# Altium project DC_DC_BOOST_CONVERTER_SOLAR.PrjPcb
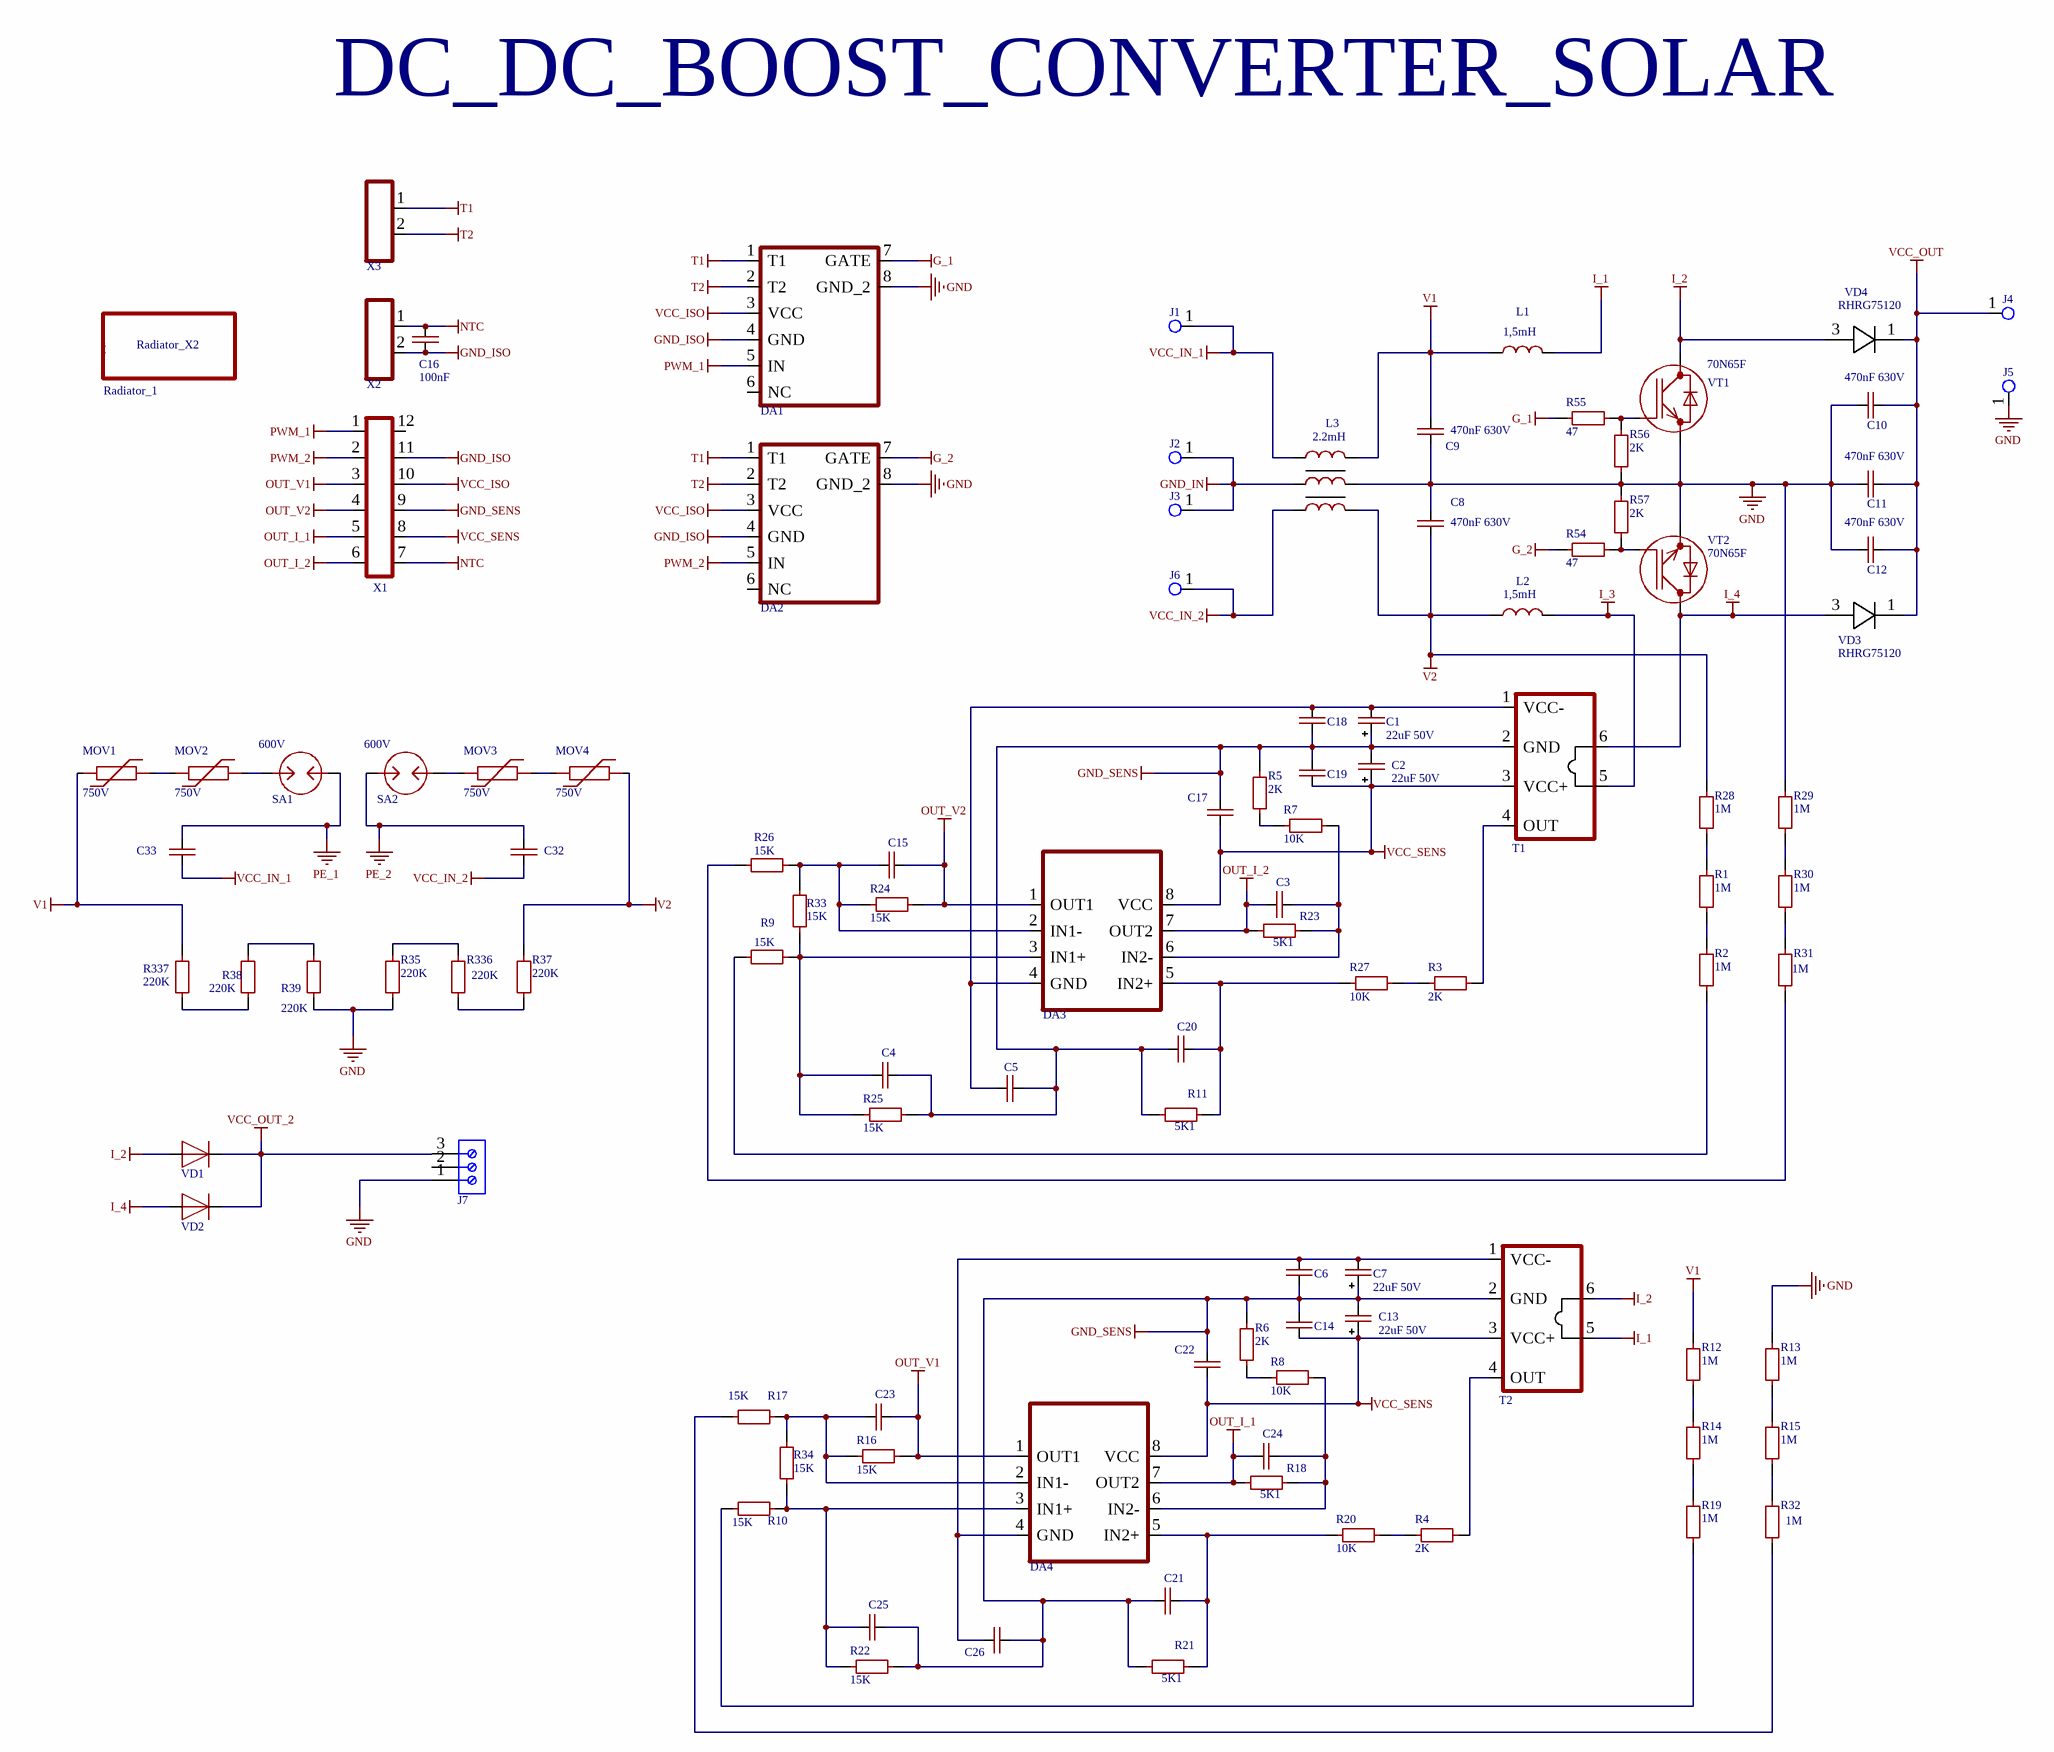
[diagram p0: DC_DC_BOOST_CONVERTER_SOLAR.SchDoc]
1 sheet, 104 parts. Net scope: global (net labels, ports and power ports of the same name join across sheets).
Board file: DC_DC_BOOST_CONVERTER_SOLAR.PcbDoc

## Sheet DC_DC_BOOST_CONVERTER_SOLAR.SchDoc
size A0; SheetNumber: 1; SheetTotal: 1; SPICEModelCacheYQEDCYZF: <root> / <DocumentId>YQEDCYZF</DocumentId> / </root>

### Parts
C1  22uF 50V  [CAPPOL_SMD_SIZE_E]
C2  22uF 50V  [CAPPOL_SMD_SIZE_E]
C3  (no value)  [CAP-0805]
C4  (no value)  [CAP-0805]
C5  (no value)  [CAP-0805]
C6  (no value)  [CAP-0805]
C7  22uF 50V  [CAPPOL_SMD_SIZE_E]
C8  470nF 630V  [CAP-FILM-22.5X26.5X10]
C9  470nF 630V  [CAP-FILM-22.5X26.5X10]
C10  470nF 630V  [CAP-FILM-22.5X26.5X10]
C11  470nF 630V  [CAP-FILM-22.5X26.5X10]
C12  470nF 630V  [CAP-FILM-22.5X26.5X10]
C13  22uF 50V  [CAPPOL_SMD_SIZE_E]
C14  (no value)  [CAP-0805]
C15  (no value)  [CAP-0805]
C16  100nF  [CAP-0805]
C17  (no value)  [CAP-0805]
C18  (no value)  [CAP-0805]
C19  (no value)  [CAP-0805]
C20  (no value)  [CAP-0805]
C21  (no value)  [CAP-0805]
C22  (no value)  [CAP-0805]
C23  (no value)  [CAP-0805]
C24  (no value)  [CAP-0805]
C25  (no value)  [CAP-0805]
C26  (no value)  [CAP-0805]
C32  (no value)  [CAP-V]
C33  (no value)  [CAP-V]
DA1  DRIVER_GATE_BOARD_solar_boost_converter  [DRIVER_GATE_BOARD_solar_boost_converter]  (value not drawn)
DA2  DRIVER_GATE_BOARD_solar_boost_converter  [DRIVER_GATE_BOARD_solar_boost_converter]  (value not drawn)
DA3  LM358  [SOIC8-150]  (value not drawn)
DA4  LM358  [SOIC8-150]  (value not drawn)
J1  (no value)  [Klema_PCB_15A]
J2  (no value)  [Klema_PCB_15A]
J3  (no value)  [Klema_PCB_15A]
J4  (no value)  [Klema_PCB_15A]
J5  (no value)  [Klema_PCB_15A]
J6  (no value)  [Klema_PCB_15A]
J7  691101710003  [691101710003]  (value not drawn)
L1  1,5mH  [DROSSEL_TOR_50X30X20]
L2  1,5mH  [DROSSEL_TOR_50X30X20]
L3  2.2mH  [DROSSEL_TOR_50X30X20X3]
MOV1  750V  [VARISTOR_20MM]
MOV2  750V  [VARISTOR_20MM]
MOV3  750V  [VARISTOR_20MM]
MOV4  750V  [VARISTOR_20MM]
R1  1M  [RES-1206]
R2  1M  [RES-1206]
R3  2K  [RES-0805]
R4  2K  [RES-0805]
R5  2K  [RES-0805]
R6  2K  [RES-0805]
R7  10K  [RES-0805]
R8  10K  [RES-0805]
R9  15K  [RES-0805]
R10  15K  [RES-0805]
R11  5K1  [RES-0805]
R12  1M  [RES-1206]
R13  1M  [RES-1206]
R14  1M  [RES-1206]
R15  1M  [RES-1206]
R16  15K  [RES-0805]
R17  15K  [RES-0805]
R18  5K1  [RES-0805]
R19  1M  [RES-1206]
R20  10K  [RES-0805]
R21  5K1  [RES-0805]
R22  15K  [RES-0805]
R23  5K1  [RES-0805]
R24  15K  [RES-0805]
R25  15K  [RES-0805]
R26  15K  [RES-0805]
R27  10K  [RES-0805]
R28  1M  [RES-1206]
R29  1M  [RES-1206]
R30  1M  [RES-1206]
R31  1M  [RES-1206]
R32  1M  [RES-1206]
R33  15K  [RES-0805]
R34  15K  [RES-0805]
R35  220K  [RES-1206]
R37  220K  [RES-1206]
R38  220K  [RES-1206]
R39  220K  [RES-1206]
R54  47  [RES-1206]
R55  47  [RES-1206]
R56  2K  [RES-1206]
R57  2K  [RES-1206]
R336  220K  [RES-1206]
R337  220K  [RES-1206]
Radiator_1  Radiator_X2  [Radiator_X2]  (value not drawn)
SA1  600V  [SPARK_GAP]
SA2  600V  [SPARK_GAP]
T1  STB-HAA20  [STB-HAA20]  (value not drawn)
T2  STB-HAA20  [STB-HAA20]  (value not drawn)
VD1  DIODE  [DIODE_R6]  (value not drawn)
VD2  DIODE  [DIODE_R6]  (value not drawn)
VD3  RHRG75120  [TO-247-2]
VD4  RHRG75120  [TO-247-2]
VT1  70N65F  [TO-247-3]
VT2  70N65F  [TO-247-3]
X1  CONN_IDC_12_PIN2.54  [CONN_IDC_12_PIN2.54]  (value not drawn)
X2  CONN-2-PIN  [XH2-]  (value not drawn)
X3  CONN-2-PIN  [XH2-]  (value not drawn)

### Nets
G_1: DA1.7(GATE) R55.2
G_2: DA2.7(GATE) R54.2
GND: C8.1 C9.2 C10.1 C11.1 C12.1 DA1.8(GND_2) DA2.8(GND_2) J5.1 J7.1 L3.4 R13.1 R29.1 R35.2 R39.2 R56.2 R57.1 VT1.3(E) VT2.3(E)
GND_IN: J2.1 J3.1 L3.3
GND_ISO: C16.2 DA1.4(GND) DA2.4(GND) X1.11 X2.2
GND_SENS: C1.1(+) C2.2(-) C4.1 C5.2 C6.1 C7.1(+) C13.2(-) C14.2 C17.2 C18.1 C19.2 C20.1 C21.1 C22.2 C25.1 C26.2 R5.1 R6.1 R11.1 R21.1 R22.2 R25.2 T1.2(GND) T2.2(GND) X1.9
I_1: L1.2 T2.5
I_2: T2.6 VD1.2(A) VD4.3 VT1.2(C)
I_3: L2.2 T1.5
I_4: T1.6 VD2.2(A) VD3.3 VT2.2(C)
NTC: C16.1 X1.7 X2.1
OUT_I_1: C24.2 DA4.7(OUT2) R18.1 X1.5
OUT_I_2: C3.2 DA3.7(OUT2) R23.1 X1.6
OUT_V1: C23.1 DA4.1(OUT1) R16.2 X1.3
OUT_V2: C15.1 DA3.1(OUT1) R24.2 X1.4
PE_1: C33.1 SA1.2
PE_2: C32.2 SA2.1
PWM_1: DA1.5(IN) X1.1
PWM_2: DA2.5(IN) X1.2
T1: DA1.1(T1) DA2.1(T1) X3.1
T2: DA1.2(T2) DA2.2(T2) X3.2
V1: C9.1 L1.1 L3.2 MOV1.1 R12.1 R337.1
V2: C8.2 L2.1 L3.6 MOV4.2 R28.1 R37.1
VCC_IN_1: C33.2 J1.1 L3.1
VCC_IN_2: C32.1 J6.1 L3.5
VCC_ISO: DA1.3(VCC) DA2.3(VCC) X1.10
VCC_OUT: C10.2 C11.2 C12.2 J4.1 VD3.1 VD4.1
VCC_OUT_2: J7.3 VD1.1(C) VD2.1(C)
VCC_SENS: C2.1(+) C13.1(+) C14.1 C17.1 C19.1 C22.1 DA3.8(VCC) DA4.8(VCC) T1.3(VCC+) T2.3(VCC+) X1.8
NetC1_2: C1.2(-) C5.1 C18.2 DA3.4(GND) T1.1(VCC-)
NetC3_1: C3.1 DA3.6(IN2-) R7.2 R23.2
NetC4_2: C4.2 DA3.3(IN1+) R9.1 R25.1 R33.1
NetC6_2: C6.2 C7.2(-) C26.1 DA4.4(GND) T2.1(VCC-)
NetC15_2: C15.2 DA3.2(IN1-) R24.1 R26.1 R33.2
NetC20_2: C20.2 DA3.5(IN2+) R11.2 R27.2
NetC21_2: C21.2 DA4.5(IN2+) R20.2 R21.2
NetC23_2: C23.2 DA4.2(IN1-) R16.1 R17.1 R34.2
NetC24_1: C24.1 DA4.6(IN2-) R8.2 R18.2
NetC25_2: C25.2 DA4.3(IN1+) R10.1 R22.1 R34.1
NetMOV1_2: MOV1.2 MOV2.1
NetMOV2_2: MOV2.2 SA1.1
NetMOV3_1: MOV3.1 SA2.2
NetMOV3_2: MOV3.2 MOV4.1
NetR1_1: R1.1 R28.2
NetR1_2: R1.2 R2.1
NetR2_2: R2.2 R9.2
NetR3_1: R3.1 T1.4(OUT)
NetR3_2: R3.2 R27.1
NetR4_1: R4.1 T2.4(OUT)
NetR4_2: R4.2 R20.1
NetR5_2: R5.2 R7.1
NetR6_2: R6.2 R8.1
NetR10_2: R10.2 R19.2
NetR12_2: R12.2 R14.1
NetR13_2: R13.2 R15.1
NetR14_2: R14.2 R19.1
NetR15_2: R15.2 R32.1
NetR17_2: R17.2 R32.2
NetR26_2: R26.2 R31.2
NetR29_2: R29.2 R30.1
NetR30_2: R30.2 R31.1
NetR35_1: R35.1 R336.1
NetR37_2: R37.2 R336.2
NetR38_1: R38.1 R39.1
NetR38_2: R38.2 R337.2
NetR54_1: R54.1 R57.2 VT2.1(G)
NetR55_1: R55.1 R56.1 VT1.1(G)

Not connected (* = marked no-connect by the designer): DA1 6(NC); DA2 6(NC); J7 2; X1 12

### Notes on the sheet
- DC_DC_BOOST_CONVERTER_SOLAR

### Library data of the parts
C1 C2 C7 C13 = CAP-POLAR
C3-C6 C8-C12 C14-C26 = CAP-NON-POLAR
C32 C33 = CAP-V
J1-J6 = Klema_15_A
J7 = 691101710003: WR-TBL Series 101 Horizontal Entry Modular, THT, pitch 5mm, 3p; Manufacturer: Wurth Elektronik; Modularity: Yes; Rated Current: 16A; Working Voltage: 250V; ComponentLink1Description: Website Link; ComponentLink1URL: https://www.we-online.com/redexpert/article/691101710003?ad; ComponentLink2Description: Datasheet Link; ComponentLink2URL: https://www.we-online.com/redexpert/spec/691101710003?ad; Manufacturer Part Number: 691101710003; Category: Terminal Blocks; Match Code: WR-TBL; Mount: Through Hole; Operating Temperature Max: 105°C; Operating Temperature Min: -40°C; Packaging: Box; Application: Pressure Clamp; Number of Pins: 3; Number of Rows: 1; Orientation: Horizontal; Pitch: 5mm
L1-L3 = IND-CONST
MOV1-MOV4 = VARISTOR
R1-R35 R37-R39 R54-R57 R336 R337 = RES-CONST
SA1 SA2 = SPARK_GAP
VD3 VD4 = MUR4060
VT1 VT2 = IGBT-N-GCE